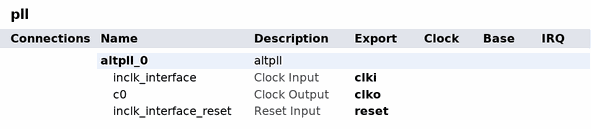
[diagram p0: system contents]
# Platform Designer (Qsys) system pll, Cyclone II EP2C5T144I8
# Parameters at their usual value, and those the tool derives, are not listed.
package require qsys
create_system pll
set_project_property DEVICE_FAMILY {Cyclone II}
set_project_property DEVICE EP2C5T144I8

add_instance altpll_0 altpll 13.0
set_instance_parameter_value altpll_0 INCLK0_INPUT_FREQUENCY 20000
set_instance_parameter_value altpll_0 GATE_LOCK_SIGNAL NO
set_instance_parameter_value altpll_0 VALID_LOCK_MULTIPLIER 1
set_instance_parameter_value altpll_0 INVALID_LOCK_MULTIPLIER 5
set_instance_parameter_value altpll_0 CLK0_MULTIPLY_BY 8
set_instance_parameter_value altpll_0 CLK0_DIVIDE_BY 1
set_instance_parameter_value altpll_0 PORT_clk1 PORT_UNUSED
set_instance_parameter_value altpll_0 PORT_clk2 PORT_UNUSED
set_instance_parameter_value altpll_0 PORT_clk3 PORT_UNUSED
set_instance_parameter_value altpll_0 PORT_ARESET PORT_UNUSED
set_instance_parameter_value altpll_0 PORT_LOCKED PORT_UNUSED

# exported interfaces
add_interface clki clock sink
set_interface_property clki EXPORT_OF altpll_0.inclk_interface
add_interface clko clock source
set_interface_property clko EXPORT_OF altpll_0.c0
add_interface reset reset sink
set_interface_property reset EXPORT_OF altpll_0.inclk_interface_reset

set_interconnect_requirement {$system} qsys_mm.clockCrossingAdapter AUTO
set_interconnect_requirement {$system} qsys_mm.maxAdditionalLatency 0

save_system pll.qsys
